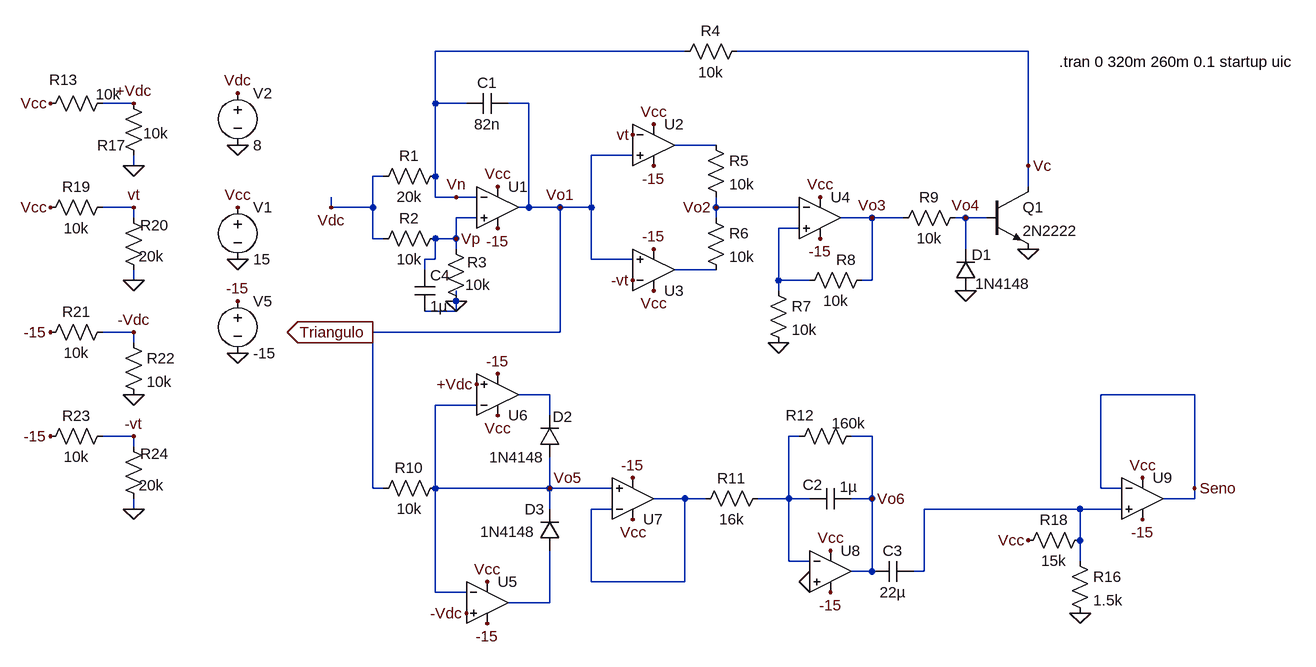
[diagram p0: schematic Circuito VCO.asc]
Circuito VCO.asc, the LTspice schematic file:
Version 4
SHEET 1 1456 1028
WIRE 448 -80 64 -80
WIRE 976 -80 528 -80
WIRE -400 0 -448 0
WIRE 64 0 64 -80
WIRE 112 0 64 0
WIRE 208 0 176 0
WIRE 496 64 432 64
WIRE 368 80 304 80
WIRE -400 96 -400 80
WIRE 976 96 976 -80
WIRE -16 112 -32 112
WIRE 64 112 64 0
WIRE 976 128 976 96
WIRE 64 144 64 112
WIRE 96 144 64 144
WIRE 128 144 96 144
WIRE -400 160 -448 160
WIRE -96 160 -96 144
WIRE -32 160 -32 112
WIRE -32 160 -96 160
WIRE 208 160 208 0
WIRE 208 160 192 160
WIRE 256 160 208 160
WIRE 304 160 304 80
WIRE 304 160 256 160
WIRE 496 160 496 144
WIRE 624 160 496 160
WIRE -400 176 -400 160
WIRE 128 176 96 176
WIRE 496 176 496 160
WIRE 736 176 688 176
WIRE 784 176 736 176
WIRE 880 176 864 176
WIRE 912 176 880 176
WIRE 624 192 592 192
WIRE -32 208 -32 160
WIRE -16 208 -32 208
WIRE 96 208 96 176
WIRE 96 208 64 208
WIRE 96 224 96 208
WIRE 880 224 880 176
WIRE 64 240 64 208
WIRE 64 240 48 240
WIRE 304 240 304 160
WIRE 368 240 304 240
WIRE 48 256 48 240
WIRE 496 256 432 256
WIRE -400 272 -400 256
WIRE 592 272 592 192
WIRE 640 272 592 272
WIRE 736 272 736 176
WIRE 736 272 720 272
WIRE 592 288 592 272
WIRE 96 304 96 288
WIRE 96 320 96 304
WIRE 96 320 48 320
WIRE -400 352 -448 352
WIRE 256 352 256 160
WIRE 256 352 -32 352
WIRE -400 368 -400 352
WIRE 240 448 192 448
WIRE 1232 448 1088 448
WIRE 128 464 64 464
WIRE 240 480 240 448
WIRE -400 512 -448 512
WIRE 624 512 608 512
WIRE 736 512 704 512
WIRE -400 528 -400 512
WIRE -32 592 -32 352
WIRE -16 592 -32 592
WIRE 64 592 64 464
WIRE 240 592 240 544
WIRE 240 592 64 592
WIRE 336 592 240 592
WIRE 1088 592 1088 448
WIRE 1120 592 1088 592
WIRE 1232 592 1232 448
WIRE 448 608 400 608
WIRE 480 608 448 608
WIRE 608 608 608 512
WIRE 608 608 560 608
WIRE 640 608 608 608
WIRE 736 608 736 512
WIRE 736 608 704 608
WIRE 1232 608 1232 592
WIRE 1232 608 1184 608
WIRE -400 624 -400 608
WIRE 240 624 240 592
WIRE 336 624 304 624
WIRE 1056 624 816 624
WIRE 1120 624 1056 624
WIRE 1056 672 1056 624
WIRE 608 704 608 608
WIRE 640 704 608 704
WIRE 1056 704 1056 672
WIRE 736 720 736 608
WIRE 736 720 704 720
WIRE 816 720 816 624
WIRE 816 720 800 720
WIRE 304 736 304 624
WIRE 448 736 448 608
WIRE 448 736 304 736
WIRE 64 752 64 592
WIRE 112 752 64 752
WIRE 240 768 240 688
WIRE 240 768 176 768
FLAG -240 240 0
FLAG -240 64 0
FLAG 160 128 Vcc
FLAG -240 160 Vcc
FLAG -240 -16 Vdc
FLAG -96 160 Vdc
FLAG 96 304 0
FLAG 400 32 Vcc
FLAG 400 288 Vcc
FLAG 592 368 0
FLAG 880 288 0
FLAG 976 224 0
FLAG 656 144 Vcc
FLAG -240 384 0
FLAG 368 48 vt
FLAG 368 272 -vt
FLAG -240 304 -15
FLAG 160 192 -15
FLAG 400 96 -15
FLAG 400 224 -15
FLAG 656 208 -15
FLAG 160 480 Vcc
FLAG 144 736 Vcc
FLAG 160 416 -15
FLAG 144 800 -15
FLAG 672 688 Vcc
FLAG 672 752 -15
FLAG 368 640 Vcc
FLAG 368 576 -15
FLAG 640 736 0
FLAG 1152 576 Vcc
FLAG 1152 640 -15
FLAG 1056 784 0
FLAG 976 672 Vcc
FLAG -32 352 Triangulo
IOPIN -32 352 Out
FLAG 1232 592 Seno
FLAG 112 784 -Vdc
FLAG 256 160 Vo1
FLAG 496 160 Vo2
FLAG 736 176 Vo3
FLAG 880 176 Vo4
FLAG 96 208 Vp
FLAG 96 144 Vn
FLAG 976 96 Vc
FLAG 240 592 Vo5
FLAG 736 608 Vo6
FLAG 128 432 +Vdc
FLAG -400 96 0
FLAG -528 0 Vcc
FLAG -400 272 0
FLAG -528 160 Vcc
FLAG -400 448 0
FLAG -400 624 0
FLAG -528 352 -15
FLAG -528 512 -15
FLAG -400 160 vt
FLAG -400 512 -vt
FLAG -400 0 +Vdc
FLAG -400 352 -Vdc
SYMBOL Opamps\\UniversalOpamp2 160 160 R0
SYMATTR InstName U1
SYMBOL res 80 96 R90
WINDOW 0 0 56 VBottom 2
WINDOW 3 32 56 VTop 2
SYMATTR InstName R1
SYMATTR Value 20k
SYMBOL res 80 192 R90
WINDOW 0 0 56 VBottom 2
WINDOW 3 32 56 VTop 2
SYMATTR InstName R2
SYMATTR Value 10k
SYMBOL res 112 320 R180
WINDOW 0 -32 76 Left 2
WINDOW 3 -37 41 Left 2
SYMATTR InstName R3
SYMATTR Value 10k
SYMBOL cap 176 -16 R90
WINDOW 0 0 32 VBottom 2
WINDOW 3 32 32 VTop 2
SYMATTR InstName C1
SYMATTR Value 82n
SYMBOL voltage -240 144 R0
WINDOW 123 0 0 Left 0
WINDOW 39 0 0 Left 0
SYMATTR InstName V1
SYMATTR Value 15
SYMBOL voltage -240 -32 R0
WINDOW 123 0 0 Left 0
WINDOW 39 0 0 Left 0
SYMATTR InstName V2
SYMATTR Value 8
SYMBOL res 544 -96 R90
WINDOW 0 0 56 VBottom 2
WINDOW 3 32 56 VTop 2
SYMATTR InstName R4
SYMATTR Value 10k
SYMBOL Opamps\\UniversalOpamp2 400 64 R0
SYMATTR InstName U2
SYMBOL Opamps\\UniversalOpamp2 400 256 M180
SYMATTR InstName U3
SYMBOL Opamps\\UniversalOpamp2 656 176 R0
SYMATTR InstName U4
SYMBOL res 480 48 R0
SYMATTR InstName R5
SYMATTR Value 10k
SYMBOL res 480 160 R0
SYMATTR InstName R6
SYMATTR Value 10k
SYMBOL res 576 272 R0
SYMATTR InstName R7
SYMATTR Value 10k
SYMBOL res 736 256 R90
WINDOW 0 0 40 VBottom 2
WINDOW 3 32 56 VTop 2
SYMATTR InstName R8
SYMATTR Value 10k
SYMBOL res 880 160 R90
WINDOW 0 0 56 VBottom 2
WINDOW 3 32 56 VTop 2
SYMATTR InstName R9
SYMATTR Value 10k
SYMBOL diode 896 288 R180
WINDOW 0 -24 55 Left 2
WINDOW 3 -83 11 Left 2
SYMATTR InstName D1
SYMATTR Value 1N4148
SYMBOL npn 912 128 R0
SYMATTR InstName Q1
SYMATTR Value 2N2222
SYMBOL voltage -240 288 R0
WINDOW 123 0 0 Left 0
WINDOW 39 0 0 Left 0
SYMATTR InstName V5
SYMATTR Value -15
SYMBOL Opamps\\UniversalOpamp2 144 768 R0
SYMATTR InstName U5
SYMBOL Opamps\\UniversalOpamp2 160 448 M180
SYMATTR InstName U6
SYMBOL Opamps\\UniversalOpamp2 672 720 R0
SYMATTR InstName U8
SYMBOL diode 256 544 R180
WINDOW 0 -19 62 Left 2
WINDOW 3 24 0 Left 2
SYMATTR InstName D2
SYMATTR Value 1N4148
SYMBOL diode 256 688 R180
WINDOW 0 24 64 Left 2
WINDOW 3 38 29 Left 2
SYMATTR InstName D3
SYMATTR Value 1N4148
SYMBOL res 80 576 R90
WINDOW 0 0 56 VBottom 2
WINDOW 3 32 56 VTop 2
SYMATTR InstName R10
SYMATTR Value 10k
SYMBOL res 576 592 R90
WINDOW 0 0 56 VBottom 2
WINDOW 3 32 56 VTop 2
SYMATTR InstName R11
SYMATTR Value 16k
SYMBOL res 720 496 R90
WINDOW 0 -1 95 VBottom 2
WINDOW 3 -20 20 VTop 2
SYMATTR InstName R12
SYMATTR Value 160k
SYMBOL cap 704 592 R90
WINDOW 0 10 59 VBottom 2
WINDOW 3 -18 4 VTop 2
SYMATTR InstName C2
SYMATTR Value 1µ
SYMBOL Opamps\\UniversalOpamp2 368 608 M180
SYMATTR InstName U7
SYMBOL cap 800 704 R90
WINDOW 0 0 32 VBottom 2
WINDOW 3 32 32 VTop 2
SYMATTR InstName C3
SYMATTR Value 22µ
SYMBOL Opamps\\UniversalOpamp2 1152 608 R0
SYMATTR InstName U9
SYMBOL res 1040 688 R0
SYMATTR InstName R16
SYMATTR Value 1.5k
SYMBOL res 1072 656 R90
WINDOW 0 0 56 VBottom 2
WINDOW 3 32 56 VTop 2
SYMATTR InstName R18
SYMATTR Value 15k
SYMBOL res -432 -16 R90
WINDOW 0 -5 76 VBottom 2
WINDOW 3 -14 7 VTop 2
SYMATTR InstName R13
SYMATTR Value 10k
SYMBOL res -416 -16 R0
WINDOW 0 -40 80 Left 2
WINDOW 3 31 62 Left 2
SYMATTR InstName R17
SYMATTR Value 10k
SYMBOL res -432 144 R90
WINDOW 0 0 56 VBottom 2
WINDOW 3 32 56 VTop 2
SYMATTR InstName R19
SYMATTR Value 10k
SYMBOL res -384 272 R180
WINDOW 0 -38 85 Left 2
WINDOW 3 -31 37 Left 2
SYMATTR InstName R20
SYMATTR Value 20k
SYMBOL res -432 336 R90
WINDOW 0 0 56 VBottom 2
WINDOW 3 32 56 VTop 2
SYMATTR InstName R21
SYMATTR Value 10k
SYMBOL res -416 352 R0
SYMATTR InstName R22
SYMATTR Value 10k
SYMBOL res -432 496 R90
WINDOW 0 0 56 VBottom 2
WINDOW 3 32 56 VTop 2
SYMATTR InstName R23
SYMATTR Value 10k
SYMBOL res -384 624 R180
WINDOW 0 -38 85 Left 2
WINDOW 3 -31 37 Left 2
SYMATTR InstName R24
SYMATTR Value 20k
SYMBOL cap 32 256 R0
SYMATTR InstName C4
SYMATTR Value 1µ
TEXT 1024 -64 Left 2 !.tran 0 320m 260m 0.1 startup uic

The netlist it stands for:
* Circuito VCO.asc
XU1 Vp Vn Vcc -15 Vo1 level.2 Avol=1Meg GBW=10Meg Slew=10Meg ilimit=25m rail=0 Vos=0 phimargin=45 en=0 enk=0 in=0 ink=0 Rin=500Meg  ; pins IN+ IN- V+ V- OUT
R1 Vn Vdc 20k
R2 Vp Vdc 10k
R3 0 Vp 10k
C1 Vo1 Vn 82n
V1 Vcc 0 15
V2 Vdc 0 8
R4 Vc Vn 10k
XU2 Vo1 vt Vcc -15 N001 level.2 Avol=1Meg GBW=10Meg Slew=10Meg ilimit=25m rail=0 Vos=0 phimargin=45 en=0 enk=0 in=0 ink=0 Rin=500Meg  ; pins IN+ IN- V+ V- OUT
XU3 Vo1 -vt Vcc -15 N003 level.2 Avol=1Meg GBW=10Meg Slew=10Meg ilimit=25m rail=0 Vos=0 phimargin=45 en=0 enk=0 in=0 ink=0 Rin=500Meg  ; pins IN+ IN- V+ V- OUT
XU4 N002 Vo2 Vcc -15 Vo3 level.2 Avol=1Meg GBW=10Meg Slew=10Meg ilimit=25m rail=0 Vos=0 phimargin=45 en=0 enk=0 in=0 ink=0 Rin=500Meg  ; pins IN+ IN- V+ V- OUT
R5 N001 Vo2 10k
R6 Vo2 N003 10k
R7 N002 0 10k
R8 Vo3 N002 10k
R9 Vo4 Vo3 10k
D1 0 Vo4 1N4148
Q1 Vc Vo4 0 0 2N2222
V5 -15 0 -15
XU5 -Vdc Vo5 Vcc -15 N008 level.2 Avol=1Meg GBW=10Meg Slew=10Meg ilimit=25m rail=0 Vos=0 phimargin=45 en=0 enk=0 in=0 ink=0 Rin=500Meg  ; pins IN+ IN- V+ V- OUT
XU6 +Vdc Vo5 Vcc -15 N004 level.2 Avol=1Meg GBW=10Meg Slew=10Meg ilimit=25m rail=0 Vos=0 phimargin=45 en=0 enk=0 in=0 ink=0 Rin=500Meg  ; pins IN+ IN- V+ V- OUT
XU8 0 N005 Vcc -15 Vo6 level.2 Avol=1Meg GBW=10Meg Slew=10Meg ilimit=25m rail=0 Vos=0 phimargin=45 en=0 enk=0 in=0 ink=0 Rin=500Meg  ; pins IN+ IN- V+ V- OUT
D2 Vo5 N004 1N4148
D3 N008 Vo5 1N4148
R10 Vo5 Vo1 10k
R11 N005 N006 16k
R12 Vo6 N005 160k
C2 Vo6 N005 1µ
XU7 Vo5 N006 Vcc -15 N006 level.2 Avol=1Meg GBW=10Meg Slew=10Meg ilimit=25m rail=0 Vos=0 phimargin=45 en=0 enk=0 in=0 ink=0 Rin=500Meg  ; pins IN+ IN- V+ V- OUT
C3 N007 Vo6 22µ
XU9 N007 Seno Vcc -15 Seno level.2 Avol=1Meg GBW=10Meg Slew=10Meg ilimit=25m rail=0 Vos=0 phimargin=45 en=0 enk=0 in=0 ink=0 Rin=500Meg  ; pins IN+ IN- V+ V- OUT
R16 N007 0 1.5k
R18 N007 Vcc 15k
R13 +Vdc Vcc 10k
R17 +Vdc 0 10k
R19 vt Vcc 10k
R20 0 vt 20k
R21 -Vdc -15 10k
R22 -Vdc 0 10k
R23 -vt -15 10k
R24 0 -vt 20k
C4 Vp 0 1µ
.model D D
.lib standard.dio
.model NPN NPN
.model PNP PNP
.lib standard.bjt
.tran 0 320m 260m 0.1 startup uic
.lib UniversalOpamps2.sub
.backanno
.end